# Altium schematic sheet Schematic.schdoc
size 297 x 209 mm; Symbol: Drawing-Symbol_A4; @Project Name: Anirban's_USB_Hub; @Page Count: 1; @Update Date: 2026-07-28; @Create Date: 2026-07-28; @Schematic Name: Schematic1; @Page No: 1; @Page Name: P1; Company: EasyEDA.com; Version: V1.0; Page Size: A4; Device: Drawing-Symbol_A4; @Create Time: 12:37:51; @Update Time: 12:37:51; Border: 1; Width: 1170; Height: 825; Region Start: 1; X Region Count: 6; Y Region Count: 4; Blade Width: 10; Title Block Position: 3; @Board Name: Board1
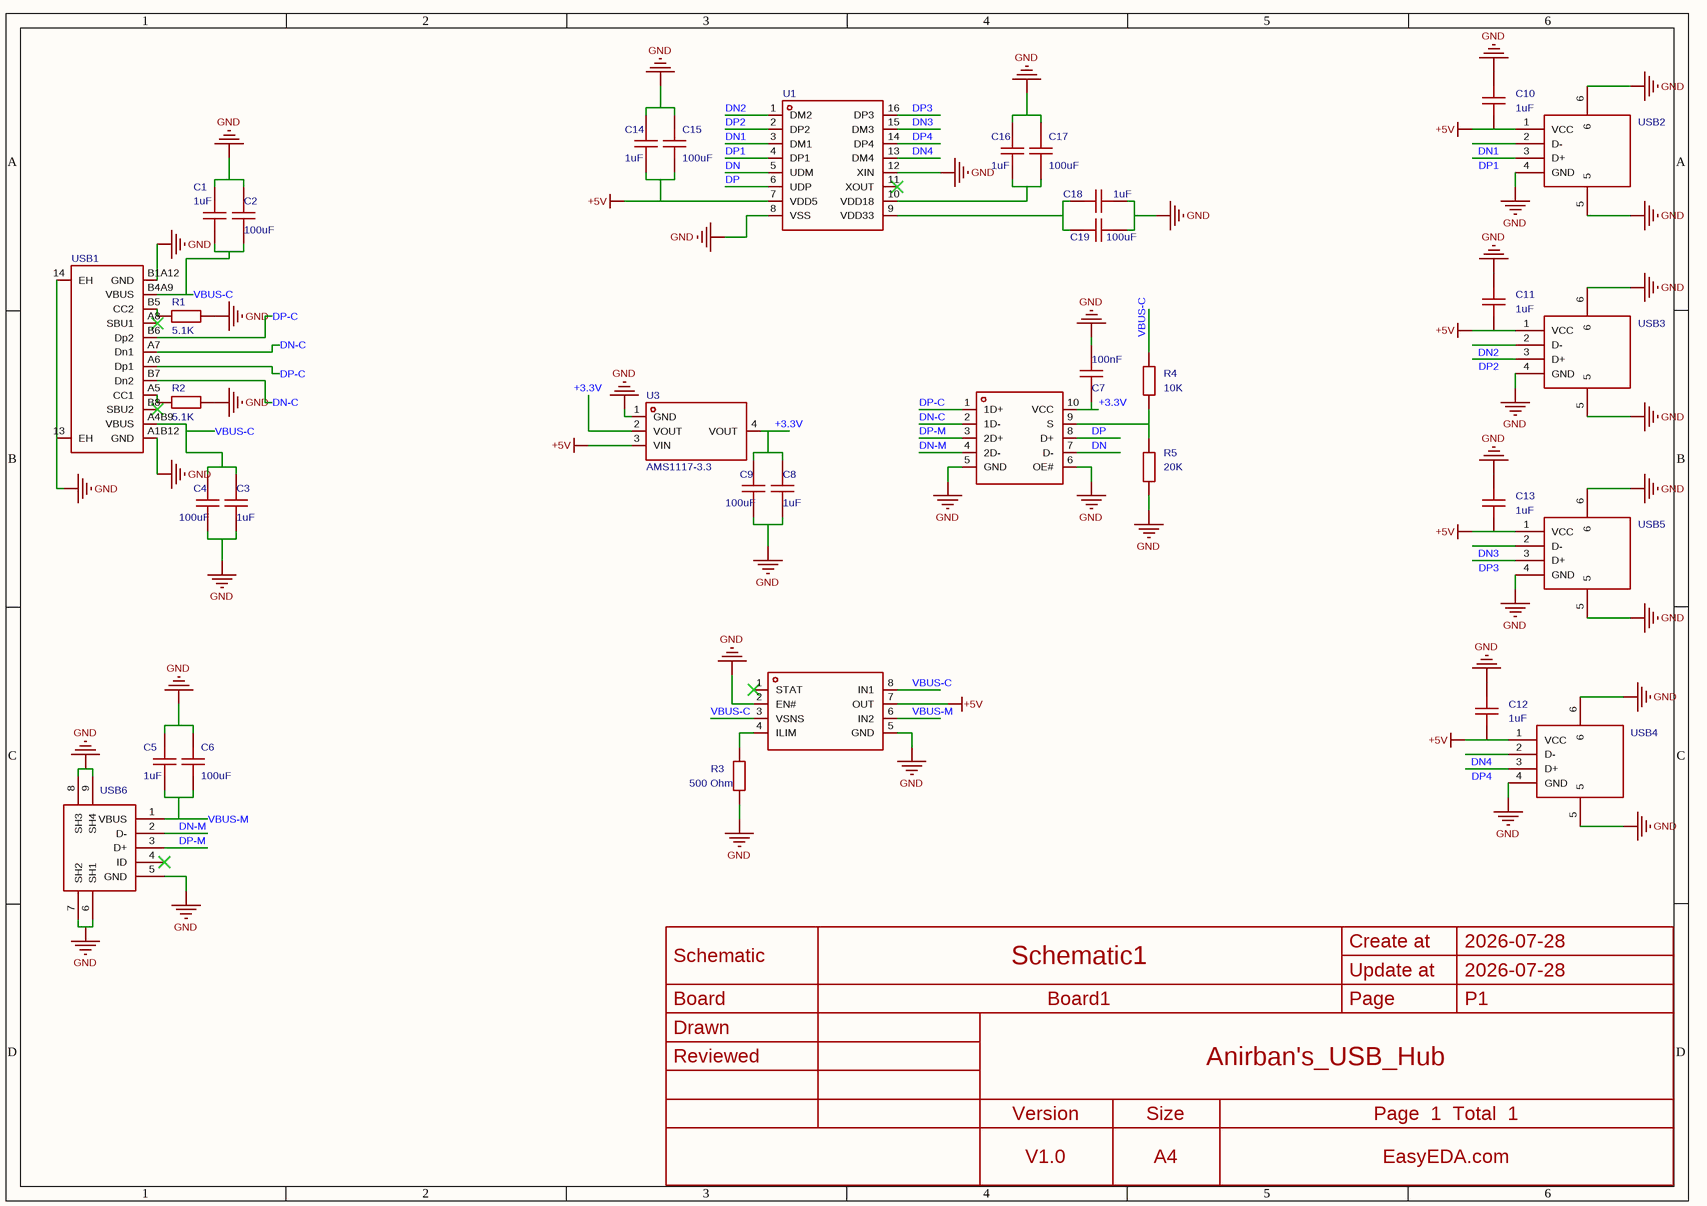
[diagram p0: Schematic.schdoc]

## Parts
C1  1uF  [C0603]
C2  100uF  [C0603]
C3  1uF  [C0603]
C4  100uF  [C0603]
C5  1uF  [C0603]
C6  100uF  [C0603]
C7  100nF  [C0603]
C8  1uF  [C0603]
C9  100uF  [C0603]
C10  1uF  [C0603]
C11  1uF  [C0603]
C12  1uF  [C0603]
C13  1uF  [C0603]
C14  1uF  [C0603]
C15  100uF  [C0603]
C16  1uF  [C0603]
C17  100uF  [C0603]
C18  1uF  [C0603]
C19  100uF  [C0603]
R1  5.1K  [R0603]
R2  5.1K  [R0603]
R3  500 Ohm  [R0603]
R4  10K  [R0603]
R5  20K  [R0603]
U1  SL2.1s  [SSOP-16_L4.6-W2.6-P0.53-LS4.0-BL]  (value not drawn)
U2  TPS2113APWR  [TSSOP-8_L4.4-W3.0-P0.65-LS6.4-BL]  (value not drawn)
U3  AMS1117-3.3  [SOT-223-3_L6.5-W3.4-P2.30-LS7.0-BR]
U4  TS3USB221RSER  [UQFN-10_L2.0-W1.5-P0.50-BL]  (value not drawn)
USB1  TYPE-C 16PIN 2MD(073)  [USB-C-SMD_TYPE-C-16PIN-2MD-073]  (value not drawn)
USB2  10.0 QHHTZB6.3  [USB-A-TH_10.0QHHTZB6.3]  (value not drawn)
USB3  10.0 QHHTZB6.3  [USB-A-TH_10.0QHHTZB6.3]  (value not drawn)
USB4  10.0 QHHTZB6.3  [USB-A-TH_10.0QHHTZB6.3]  (value not drawn)
USB5  10.0 QHHTZB6.3  [USB-A-TH_10.0QHHTZB6.3]  (value not drawn)
USB6  MicroXNJ  [MICRO-USB-SMD_MICROXNJ_1]  (value not drawn)

## Nets
+5V: C10.2 C11.2 C12.2 C13.2 C14.2 C15.2 U1.7(VDD5) U2.7(OUT) U3.3(VIN) USB2.1(VCC) USB3.1(VCC) USB4.1(VCC) USB5.1(VCC)
GND: C1.1 C2.1 C3.1 C4.1 C5.1 C6.1 C7.1 C8.1 C9.1 C10.1 C11.1 C12.1 C13.1 C14.1 C15.1 C16.1 C17.1 C18.1 C19.1 R1.1 R2.1 R3.1 R5.1 U1.8(VSS) U1.12(XIN) U2.2(EN#) U2.5(GND) U3.1(GND) U4.5(GND) U4.6(OE#) USB1.13(EH) USB1.14(EH) USB1.A1B12(GND) USB1.B1A12(GND) USB2.4(GND) USB2.5 USB2.6 USB3.4(GND) USB3.5 USB3.6 USB4.4(GND) USB4.5 USB4.6 USB5.4(GND) USB5.5 USB5.6 USB6.5(GND) USB6.6(SH1) USB6.7(SH2) USB6.8(SH3) USB6.9(SH4)
+3.3V: C7.2 C8.2 C9.2 U3.2(VOUT) U3.4(VOUT) U4.10(VCC)
DN: U1.5(UDM) U4.7(D-)
DN1: U1.3(DM1) USB2.2(D-)
DN2: U1.1(DM2) USB3.2(D-)
DN3: U1.15(DM3) USB5.2(D-)
DN4: U1.13(DM4) USB4.2(D-)
DN-C: U4.2(1D-) USB1.A7(Dn1) USB1.B7(Dn2)
DN-M: U4.4(2D-) USB6.2(D-)
DP: U1.6(UDP) U4.8(D+)
DP1: U1.4(DP1) USB2.3(D+)
DP2: U1.2(DP2) USB3.3(D+)
DP3: U1.16(DP3) USB5.3(D+)
DP4: U1.14(DP4) USB4.3(D+)
DP-C: U4.1(1D+) USB1.A6(Dp1) USB1.B6(Dp2)
DP-M: U4.3(2D+) USB6.3(D+)
VBUS-C: C1.2 C2.2 C3.2 C4.2 R4.2 U2.3(VSNS) U2.8(IN1) USB1.A4B9(VBUS) USB1.B4A9(VBUS)
VBUS-M: C5.2 C6.2 U2.6(IN2) USB6.1(VBUS)
NetC16_2: C16.2 C17.2 U1.10(VDD18)
NetC18_2: C18.2 C19.2 U1.9(VDD33)
NetR1_2: R1.2 USB1.B5(CC2)
NetR2_2: R2.2 USB1.A5(CC1)
NetR3_2: R3.2 U2.4(ILIM)
NetR4_1: R4.1 R5.2 U4.9(S)

Not connected (* = marked no-connect by the designer): U1 11(XOUT)*; U2 1(STAT)*; USB1 A8(SBU1)* B8(SBU2)*; USB6 4(ID)*

## Notes on the sheet
- Create at
- 2026-07-28
- Schematic
- Board
- Schematic1
- Board1
- Update at
- Page
- P1
- Drawn
- Reviewed
- Anirban's_USB_Hub
- Version
- V1.0
- Size
- A4
- Page  1  Total  1
- EasyEDA.com

## Library data of the parts
C1-C4 = CAP_0603: Symbol: CAP_OLD; ConvertToPcb: yes; ModelId: 624118aa3cc7497086c383c2d72e08520819f05c4eef4c71ace90d822a990e87; ModelName: C0603_L1.6-W0.8-H0.8; ModelTransform: 62.992,31.496,0,0,0,0,0,0,0; Value: 100nF; Device: CAP_0603; AddInBom: yes; Supplier Footprint: 0603; FootprintName: C0603
C5 C6 C8 C9 C14-C19 = CAP_0603: Symbol: CAP_OLD; 3D Model: 624118aa3cc7497086c383c2d72e08520819f05c4eef4c71ace90d822a990e87; 3D Model Transform: 62.992,31.496,0,0,0,0,0,0,0; Value: 100nF; ConvertToPcb: yes; ModelName: C0603_L1.6-W0.8-H0.8; Device: CAP_0603; Supplier Footprint: 0603; AddInBom: yes; FootprintName: C0603
C7 C10-C13 = CAP_0603: Symbol: CAP_OLD; 3D Model: 624118aa3cc7497086c383c2d72e08520819f05c4eef4c71ace90d822a990e87; 3D Model Transform: 62.992,31.496,0,0,0,0,0,0,0; ConvertToPcb: yes; ModelName: C0603_L1.6-W0.8-H0.8; Device: CAP_0603; Supplier Footprint: 0603; AddInBom: yes; FootprintName: C0603
  C7: Value: 100nF
  C10-C13: Value: 1uF
R1 R2 = Res_0603: Symbol: Res; ConvertToPcb: yes; ModelId: 112863783b5b41f1b5254f87eedc79320819f05c4eef4c71ace90d822a990e87; ModelTransform: 31.8897,63.7794,0,90,0,0,0,0,0; Device: Res_0603; Value: 5.1K; AddInBom: yes; Supplier Footprint: 0603; FootprintName: R0603; ModelName: R0603
R3 R4 = Res_0603: Symbol: Res; 3D Model: 112863783b5b41f1b5254f87eedc79320819f05c4eef4c71ace90d822a990e87; 3D Model Transform: 31.8897,63.7794,0,90,0,0,0,0,0; ConvertToPcb: yes; Device: Res_0603; Supplier Footprint: 0603; AddInBom: yes; FootprintName: R0603; ModelName: R0603
  R3: Value: 500 Ohm
  R4: Value: 10K
R5 = Res_0603: Symbol: Res; 3D Model: 112863783b5b41f1b5254f87eedc79320819f05c4eef4c71ace90d822a990e87; 3D Model Transform: 31.8897,63.7794,0,90,0,0,0,0,0; Value: 10K; ConvertToPcb: yes; Device: Res_0603; Supplier Footprint: 0603; AddInBom: yes; FootprintName: R0603; ModelName: R0603
U1 = SL2.1s: type:Hub USB Protocol:USB 2.0 Data Rate:- Voltage - Supply:4V~5.25V Voltage - Supply:4V~5.25V Operating Temperature:0℃~+70℃ Operating Temperature:0℃~+70℃ Memory Interface:- Current - Supply:120mA Quiescent Supply Current:2.5mA Number of Channels:4; Manufacturer: CoreChips(和芯润德); AddInBom: yes; ModelId: 51a6e623206b4556b6fb8763b965e86a0819f05c4eef4c71ace90d822a990e87; ModelTransform: 181.102,157.48,0,0,0,0,0,0,0; USB Protocol: USB 2.0; Current - Supply: 120mA; Quiescent Supply Current: 2.5mA; Number of Channels: 4; Symbol: SL2.1S; Device: SL2.1s; LCSC Part Name: USB2.0 HUB控制器集成电路; SupplierPart: C2684433; ManufacturerPart: SL2.1s; Supplier Footprint: SSOP-16; JLCPCB Part Class: Extended Part; Datasheet: https://item.szlcsc.com/datasheet/SL2.1s/2782346.html; Supplier: LCSC; ConvertToPcb: yes; FootprintName: SSOP-16_L4.6-W2.6-P0.53-LS4.0-BL; ModelName: SSOP-16_L4.6-W2.6-P0.53-LS4.0-BL; type: Hub; Data Rate: -; Voltage - Supply: 4V~5.25V; Operating Temperature: 0℃~+70℃; Memory Interface: -
U2 = TPS2113APWR: Type:Load Switch Number of Channels:1 Control Input Logic:Active High Voltage - Supply:2.8V~5.5V Voltage - Supply:2.8V~5.5V Maximum Continuous Current:2A RDS(on):84mΩ Features:Overcurrent Protection；Integrated charge pump；Reverse current blocking；Soft-sta; Manufacturer: TI(德州仪器); AddInBom: yes; ModelId: 66f3fe7ddd4b4af78d3bf971beb31d720819f05c4eef4c71ace90d822a990e87; ModelName: TSSOP-8_L4.4-W3.0-P0.65-LS6.4-BL-2; ModelTransform: 118.11,251.968,0,0,0,0,0,0,0; Number of Channels: 1; Maximum Continuous Current: 2A; RDS(on): 84mΩ; Symbol: TPS2113APWR; Device: TPS2113APWR; Supplier: LCSC; Manufacturer Part: TPS2113APWR; Supplier Part: C130052; JLCPCB Part Class: Extended Part; LCSC Part Name: 双输入单输出电源多路复用器; Supplier Footprint: TSSOP-8; Datasheet: https://www.ti.com/cn/lit/ds/symlink/tps2113a.pdf; ConvertToPcb: yes; FootprintName: TSSOP-8_L4.4-W3.0-P0.65-LS6.4-BL; Type: Load Switch; Control Input Logic: Active High; Voltage - Supply: 2.8V~5.5V; Features: Overcurrent Protection；Integrated charge pump；Reverse current blocking；Soft-start；Over temperature protection；Under-voltage lockout; Operating Temperature	-: -40℃~+85℃
U3 = AMS1117-3.3_C22466222: Output Configuration:Positive Voltage - Supply:15V Output Voltage:3.3V Output Voltage:3.3V Output Current:1A Power Supply Rejection Ratio (PSRR):- Voltage Dropout:1.1V@(1A) standby current:4mA Noise:- Features:Over Current Protection；Thermal shutdown Oper; Manufacturer: TDSEMIC(拓电半导体); AddInBom: yes; ModelId: e5f8b32b785646b6abbef6d5ae2fe0600819f05c4eef4c71ace90d822a990e87; ModelName: SOT-223-4P_L6.5-W3.5-H1.6-LS7.0-P2.30; ModelTransform: 279.89794,255.905,0,180,0,0,-3.9385,-0.0005,0; Voltage - Supply: 15V; Output Voltage: 3.3V; standby current: 4mA; Output Type: Fixed; Number of Outputs: 1; Symbol: AMS1117-3.3_C22466222; Device: AMS1117-3.3_C22466222; LCSC Part Name: 3.3V 1A 15V; SupplierPart: C22466222; ManufacturerPart: AMS1117-3.3; Supplier Footprint: SOT223; JLCPCB Part Class: Extended Part; Datasheet: https://item.szlcsc.com/datasheet/AMS1117-3.3/24165574.html; Supplier: LCSC; ConvertToPcb: yes; FootprintName: SOT-223-3_L6.5-W3.4-P2.30-LS7.0-BR; Output Configuration: Positive; Output Current: 1A; Power Supply Rejection Ratio (PSRR): -; Voltage Dropout: 1.1V@(1A); Noise: -; Features: Over Current Protection；Thermal shutdown; Operating Temperature: -40℃~+125℃@(Ta)
U4 = TS3USB221RSER: Switch Circuit:SPDT(SPDT) -3dB Bandwidth:1.1GHz Voltage - Supply:2.3V~3.6V Voltage - Supply:2.3V~3.6V RDS(on):6Ω Operating Temperature:-40℃~+85℃ Operating Temperature:-40℃~+85℃; Manufacturer: TI(德州仪器); AddInBom: yes; ModelId: 8275189e665f413398babb194fc3ae920819f05c4eef4c71ace90d822a990e87; ModelName: UQFN-10_L2.0-W1.5-H0.6-P0.50; ModelTransform: 79.527,59.8424,0,0,0,0,0,0,0; -3dB Bandwidth: 1.1GHz; RDS(on): 6Ω; Symbol: TS3USB221RSER; Device: TS3USB221RSER; LCSC Part Name: TS3USB221 单使能开关; SupplierPart: C130085; ManufacturerPart: TS3USB221RSER; Supplier Footprint: UQFN-10(1.5x2); JLCPCB Part Class: Extended Part; Datasheet: https://www.ti.com/cn/lit/gpn/ts3usb221; Supplier: LCSC; ConvertToPcb: yes; FootprintName: UQFN-10_L2.0-W1.5-P0.50-BL; Switch Circuit: SPDT(SPDT); Voltage - Supply: 2.3V~3.6V; Operating Temperature: -40℃~+85℃
USB1 = TYPE-C 16PIN 2MD(073): Connector Type:Type-C Protocol Standard:- Gender:Female Mounting Type:Surface Mount, Right Angle Number of Contacts:16P Number of Ports:1 Current Rating-Power:3A Voltage Rating:5V Connect-Disconnect Life:10,000 cycles Supplementary Features:- Center Heigh; Manufacturer: SHOU HAN(首韩); AddInBom: yes; ModelId: e7514eef573e45b68df9e9a6124b25320819f05c4eef4c71ace90d822a990e87; ModelName: USB-C-SMD_TYPE-C-6PIN-2MD-073; ModelTransform: 351.9678,298.4246,0,0,0,0,0,-47.244,-35.433; Gender: Female; Number of Contacts: 16P; Number of Ports: 1; Current Rating-Power: 3A; Voltage Rating: 5V; Detection color: Black; Symbol: TYPE-C 16PIN 2MD(073); Device: TYPE-C 16PIN 2MD(073); LCSC Part Name: Type-C 母 卧贴; SupplierPart: C2765186; ManufacturerPart: TYPE-C 16PIN 2MD(073); Supplier Footprint: SMD; JLCPCB Part Class: Extended Part; Datasheet: https://item.szlcsc.com/datasheet/TYPE-C%252016PIN%25202MD(073)/2901843.html; Supplier: LCSC; ConvertToPcb: yes; FootprintName: USB-C-SMD_TYPE-C-16PIN-2MD-073; Connector Type: Type-C; Protocol Standard: -; Mounting Type: Surface Mount, Right Angle; Connect-Disconnect Life: 10,000 cycles; Supplementary Features: -; Center Height: -; Length: -; Operating Temperature: -25℃~+85℃
USB2 = 10.0 QHHTZB6.3: Connector Type:Type-A Protocol Standard:USB 2.0 Gender:Female Mounting Type:Surface Mount, Right Angle Number of Contacts:4P Number of Ports:1 Current Rating-Power:1.5A Voltage Rating:30V Connect-Disconnect Life:5,000 times Supplementary Features:- Center; Manufacturer: SHOU HAN(首韩); AddInBom: yes; ModelId: 75e466e9528a4761bf0136761e1833720819f05c4eef4c71ace90d822a990e87; ModelTransform: 570.865,448.818,0,0,0,0,0,-51.182,-78.74; Connector Type: Type-A; Protocol Standard: USB 2.0; Gender: Female; Number of Contacts: 4P; Number of Ports: 1; Current Rating-Power: 1.5A; Voltage Rating: 30V; Detection color: Black; Symbol: 10.0 QHHTZB6.3; Device: 10.0 QHHTZB6.3; LCSC Part Name: 壳长10.0mm; SupplierPart: C668591; ManufacturerPart: 10.0 QHHTZB6.3; Supplier Footprint: SMD; JLCPCB Part Class: Extended Part; Datasheet: https://item.szlcsc.com/datasheet/10.0%2520QHHTZB6.3/698534.html; Supplier: LCSC; ConvertToPcb: yes; FootprintName: USB-A-TH_10.0QHHTZB6.3; ModelName: USB-A-TH_10.0QHHTZB6.3; Mounting Type: Surface Mount, Right Angle; Connect-Disconnect Life: 5,000 times; Supplementary Features: -; Center Height: -; Length: 10mm; Operating Temperature: -25℃~+85℃
USB3-USB5 = 10.0 QHHTZB6.3: Connector Type:Type-A Protocol Standard:USB 2.0 Gender:Female Mounting Type:Surface Mount, Right Angle Number of Contacts:4P Number of Ports:1 Current Rating-Power:1.5A Voltage Rating:30V Connect-Disconnect Life:5,000 times Supplementary Features:- Center; Manufacturer: SHOU HAN(首韩); 3D Model: 75e466e9528a4761bf0136761e1833720819f05c4eef4c71ace90d822a990e87; 3D Model Transform: 570.865,448.818,0,0,0,0,0,-51.182,-78.74; Connector Type: Type-A; Protocol Standard: USB 2.0; Gender: Female; Number of Contacts: 4P; Number of Ports: 1; Current Rating-Power: 1.5A; Voltage Rating: 30V; Detection color: Black; AddInBom: yes; Symbol: 10.0 QHHTZB6.3; Device: 10.0 QHHTZB6.3; LCSC Part Name: 壳长10.0mm; Supplier Part: C668591; Manufacturer Part: 10.0 QHHTZB6.3; Supplier Footprint: SMD; JLCPCB Part Class: Extended Part; Datasheet: https://item.szlcsc.com/datasheet/10.0%2520QHHTZB6.3/698534.html; Supplier: LCSC; Mounting Type: Surface Mount, Right Angle; Connect-Disconnect Life: 5,000 times; Supplementary Features: -; Center Height: -; Length: 10mm; Operating Temperature: -25℃~+85℃; ConvertToPcb: yes; FootprintName: USB-A-TH_10.0QHHTZB6.3; ModelName: USB-A-TH_10.0QHHTZB6.3
USB6 = MicroXNJ: Connector Type:Micro-B Protocol Standard:USB 2.0 Gender:Female Mounting Type:Surface Mount, Right Angle Number of Contacts:5P Number of Ports:1 Current Rating-Power:1.8A Voltage Rating:30V Connect-Disconnect Life:5,000 times Detection color:Black Operatin; Manufacturer: SHOU HAN(首韩); AddInBom: yes; ModelId: 07f19d99124842279e005434ddbfbe7f0819f05c4eef4c71ace90d822a990e87; ModelTransform: 314.96,234.80992,0,90,0,0,34.256,-0.597,-35.433; Protocol Standard: USB 2.0; Gender: Female; Number of Contacts: 5P; Number of Ports: 1; Current Rating-Power: 1.8A; Voltage Rating: 30V; Detection color: Black; Symbol: MICROXNJ; Device: MicroXNJ; LCSC Part Name: Micro小牛角卧贴母座; SupplierPart: C404969; ManufacturerPart: MicroXNJ; Supplier Footprint: SMD; JLCPCB Part Class: Extended Part; Datasheet: https://item.szlcsc.com/datasheet/MicroXNJ/392534.html; Supplier: LCSC; ConvertToPcb: yes; FootprintName: MICRO-USB-SMD_MICROXNJ_1; ModelName: MICRO-USB-SMD_MICROXNJ_1; Connector Type: Micro-B; Mounting Type: Surface Mount, Right Angle; Connect-Disconnect Life: 5,000 times; Operating Temperature: -20℃~+85℃